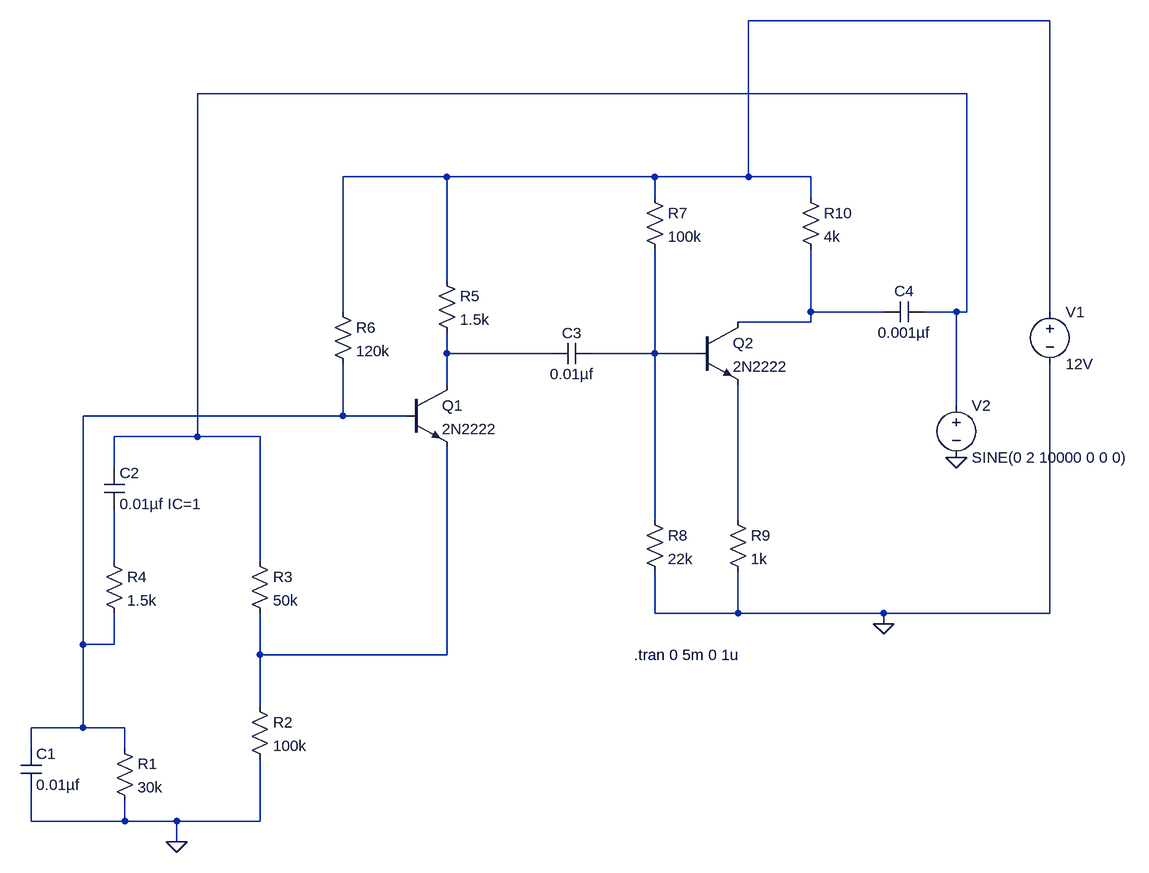
[diagram p0: schematic wein bridge oscillator.asc]
wein bridge oscillator.asc, the LTspice schematic file:
Version 4.1
SHEET 1 2048 680
WIRE 1712 -960 1248 -960
WIRE 1584 -848 400 -848
WIRE 784 -720 624 -720
WIRE 1104 -720 784 -720
WIRE 1248 -720 1248 -960
WIRE 1248 -720 1104 -720
WIRE 1344 -720 1248 -720
WIRE 1104 -688 1104 -720
WIRE 1344 -688 1344 -720
WIRE 784 -560 784 -720
WIRE 624 -512 624 -720
WIRE 1344 -512 1344 -608
WIRE 1456 -512 1344 -512
WIRE 1568 -512 1520 -512
WIRE 1584 -512 1584 -848
WIRE 1584 -512 1568 -512
WIRE 1712 -512 1712 -960
WIRE 1344 -496 1344 -512
WIRE 1344 -496 1232 -496
WIRE 784 -448 784 -480
WIRE 944 -448 784 -448
WIRE 1104 -448 1104 -608
WIRE 1104 -448 1008 -448
WIRE 1168 -448 1104 -448
WIRE 784 -400 784 -448
WIRE 1568 -368 1568 -512
WIRE 624 -352 624 -432
WIRE 624 -352 224 -352
WIRE 720 -352 624 -352
WIRE 400 -320 400 -848
WIRE 400 -320 272 -320
WIRE 496 -320 400 -320
WIRE 272 -272 272 -320
WIRE 1104 -192 1104 -448
WIRE 1232 -192 1232 -400
WIRE 272 -128 272 -208
WIRE 496 -128 496 -320
WIRE 1104 -48 1104 -112
WIRE 1232 -48 1232 -112
WIRE 1232 -48 1104 -48
WIRE 1456 -48 1232 -48
WIRE 1712 -48 1712 -432
WIRE 1712 -48 1456 -48
WIRE 1456 -32 1456 -48
WIRE 224 0 224 -352
WIRE 272 0 272 -48
WIRE 272 0 224 0
WIRE 496 16 496 -48
WIRE 784 16 784 -304
WIRE 784 16 496 16
WIRE 496 96 496 16
WIRE 224 128 224 0
WIRE 224 128 144 128
WIRE 288 128 224 128
WIRE 144 160 144 128
WIRE 288 160 288 128
WIRE 144 272 144 224
WIRE 288 272 288 240
WIRE 288 272 144 272
WIRE 368 272 288 272
WIRE 496 272 496 176
WIRE 496 272 368 272
WIRE 368 304 368 272
FLAG 368 304 0
FLAG 1456 -32 0
FLAG 1568 -288 0
SYMBOL cap 128 160 R0
SYMATTR InstName C1
SYMATTR Value 0.01µf
SYMBOL res 272 144 R0
SYMATTR InstName R1
SYMATTR Value 30k
SYMBOL res 480 80 R0
SYMATTR InstName R2
SYMATTR Value 100k
SYMBOL res 480 -144 R0
SYMATTR InstName R3
SYMATTR Value 50k
SYMBOL res 256 -144 R0
SYMATTR InstName R4
SYMATTR Value 1.5k
SYMBOL cap 256 -272 R0
SYMATTR InstName C2
SYMATTR Value 0.01µf IC=1
SYMBOL npn 720 -400 R0
SYMATTR InstName Q1
SYMATTR Value 2N2222
SYMBOL res 768 -576 R0
SYMATTR InstName R5
SYMATTR Value 1.5k
SYMBOL res 608 -528 R0
SYMATTR InstName R6
SYMATTR Value 120k
SYMBOL npn 1168 -496 R0
SYMATTR InstName Q2
SYMATTR Value 2N2222
SYMBOL cap 1008 -464 R90
WINDOW 0 0 32 VBottom 2
WINDOW 3 32 32 VTop 2
SYMATTR InstName C3
SYMATTR Value 0.01µf
SYMBOL res 1088 -704 R0
SYMATTR InstName R7
SYMATTR Value 100k
SYMBOL res 1088 -208 R0
SYMATTR InstName R8
SYMATTR Value 22k
SYMBOL res 1216 -208 R0
SYMATTR InstName R9
SYMATTR Value 1k
SYMBOL res 1328 -704 R0
SYMATTR InstName R10
SYMATTR Value 4k
SYMBOL voltage 1712 -528 R0
WINDOW 123 0 0 Left 0
WINDOW 39 0 0 Left 0
SYMATTR InstName V1
SYMATTR Value 12V
SYMBOL cap 1520 -528 R90
WINDOW 0 0 32 VBottom 2
WINDOW 3 32 32 VTop 2
SYMATTR InstName C4
SYMATTR Value 0.001µf
SYMBOL voltage 1568 -384 R0
WINDOW 123 0 0 Left 0
WINDOW 39 0 0 Left 0
SYMATTR InstName V2
SYMATTR Value SINE(0 2 10000 0 0 0)
TEXT 1072 16 Left 2 !.tran 0 5m 0 1u

The netlist it stands for:
* wein bridge oscillator.asc
C1 N006 0 0.01µf
R1 N006 0 30k
R2 N009 0 100k
R3 N002 N009 50k
R4 N008 N006 1.5k
C2 N002 N008 0.01µf IC=1
Q1 N004 N006 N009 0 2N2222
R5 N001 N004 1.5k
R6 N001 N006 120k
Q2 N003 N005 N007 0 2N2222
C3 N005 N004 0.01µf
R7 N001 N005 100k
R8 N005 0 22k
R9 N007 0 1k
R10 N001 N003 4k
V1 N001 0 12V
C4 N002 N003 0.001µf
V2 N002 0 SINE(0 2 10000 0 0 0)
.model NPN NPN
.model PNP PNP
.lib standard.bjt
.tran 0 5m 0 1u
.backanno
.end